# Altium schematic sheet DC_POWER_Block.SchDoc
size A4; CheckedBy: CT-Energys; Author: CT-Energys; CompanyName: HTD COMPANY LIMITED; DrawnBy: CHITOAN; Engineer: CHITOAN; Organization: Altium Limited; Address1: HO CHI MINH CITY; Address2: VIETNAM
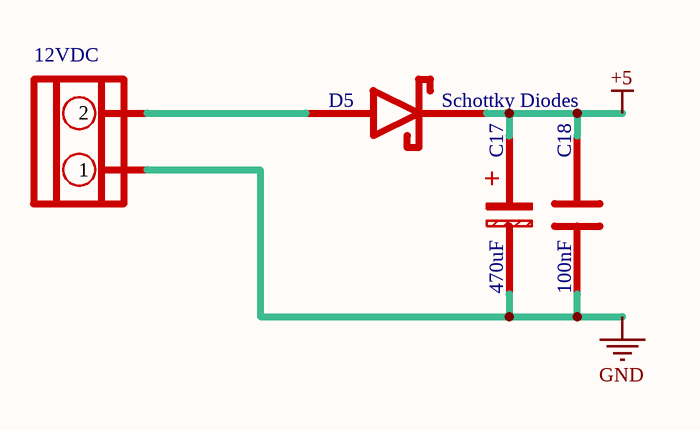
[diagram p0: DC_POWER_Block.SchDoc]

## Parts
C17  470uF  [CAP-AL-4x5.4]
C18  100nF  [C0805]
D5  Schottky Diodes  [SMA]
H3  12VDC  [KF301-2-V]

## Nets
+5: C17.1 C18.2 D5.K
GND: C17.2 C18.1 H3.1
NetD5_A: D5.A H3.2

## Notes on the sheet
- Title
- Size:
- Date:
- A4
- Number:
- Time:
- Revision:
- Design by:
- Company:
- File:
- (in symbol CAP-ALU) +

## Library data of the parts
C17 = CAP-ALU: Aluminum Capacitor
C18 = CAP-CER: Ceramic Capacitor
D5 = Diode_Schottky
H3 = KF301-2-V: Connector 5.08MM Pitch Vertical 2 Pole